# Altium schematic sheet Main.SchDoc
size 420 x 297 mm; Author: Гавриленко; Address1: Address1; Address2: Address2; Address3: Address3; Address4: Address4; SheetNumber: 1; SheetTotal: 11; DocumentType: Схема электрическая принципиальная
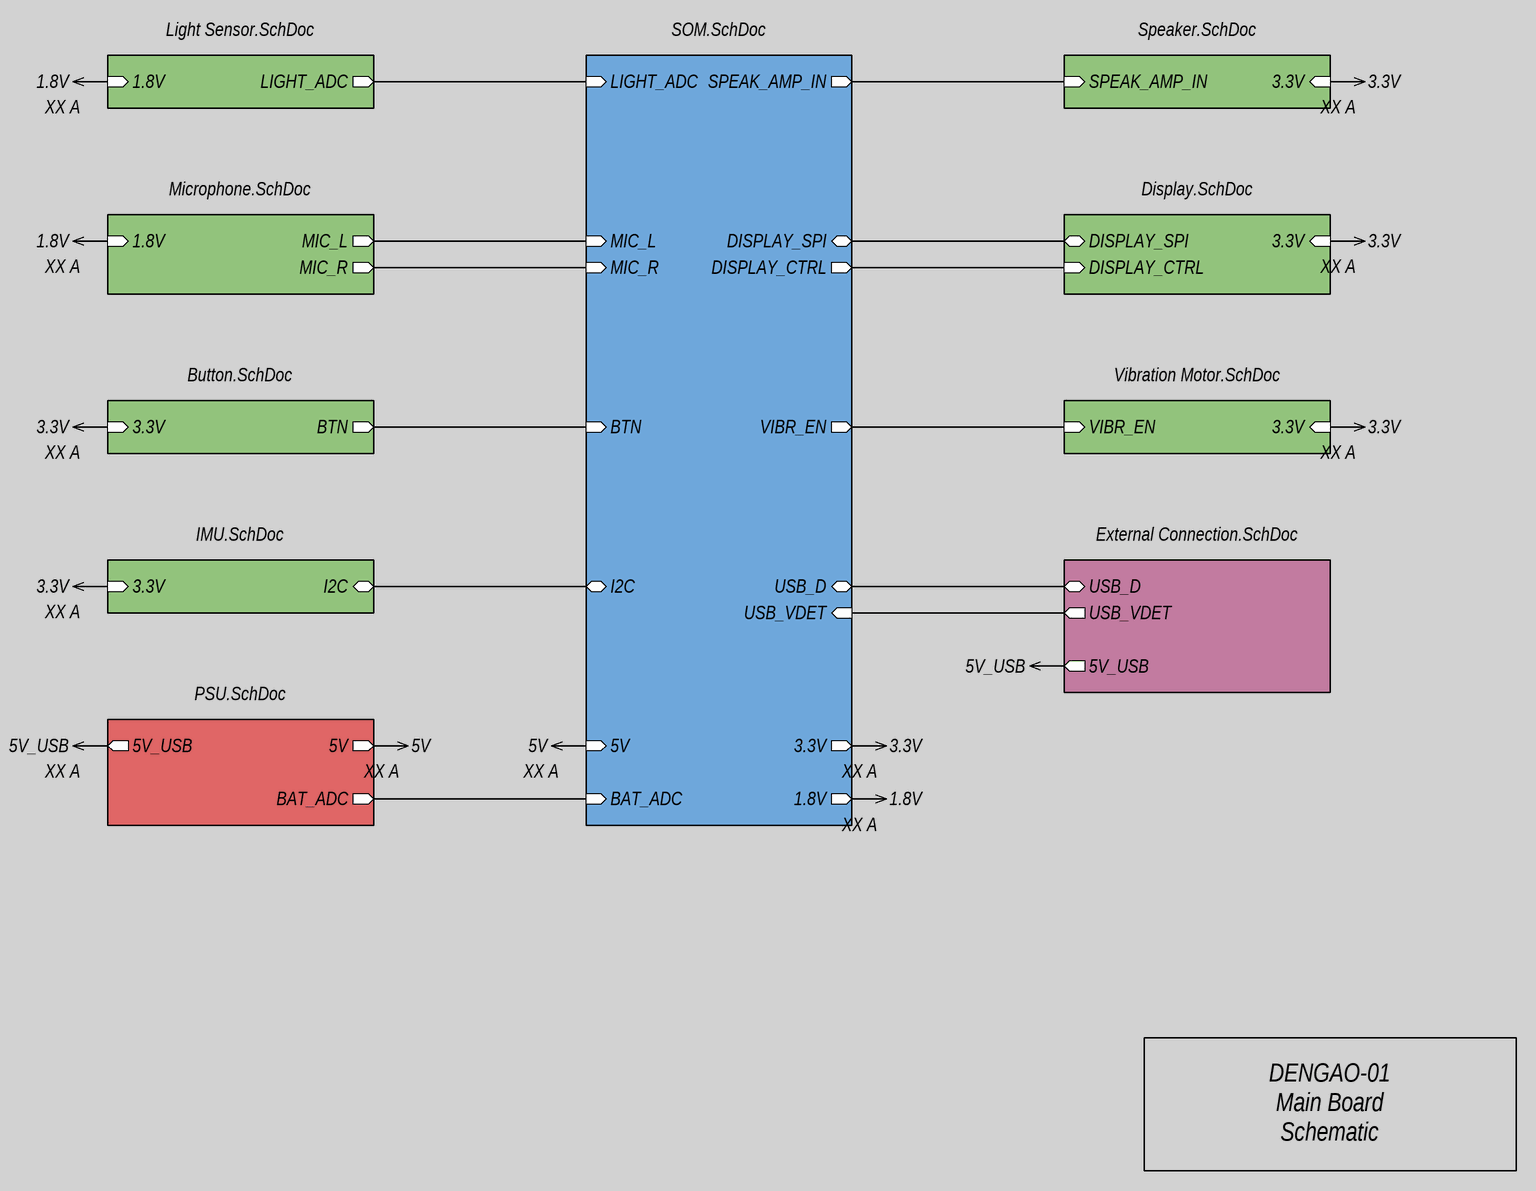
[diagram p0: Main.SchDoc]

## Sub-sheets
Designator = SOM.SchDoc: 5V (in), 3.3V (out), 1.8V (out), BAT_ADC (in), I2C (bidir), BTN (in), MIC_R (in), MIC_L (in), LIGHT_ADC (in), SPEAK_AMP_IN (out), DISPLAY_SPI (bidir), DISPLAY_CTRL (out), VIBR_EN (out), USB_D (bidir), USB_VDET (in)
Designator = IMU.SchDoc: I2C (bidir), 3.3V (in)
Designator = Microphone.SchDoc: MIC_L (out), 1.8V (in), MIC_R (out)
Designator = Speaker.SchDoc: SPEAK_AMP_IN (in), 3.3V (in)
Designator = Display.SchDoc: DISPLAY_SPI (bidir), DISPLAY_CTRL (in), 3.3V (in)
Designator = PSU.SchDoc: 5V (out), 5V_USB (out), BAT_ADC (out)
Designator = Button.SchDoc: BTN (out), 3.3V (in)
Designator = Light Sensor.SchDoc: LIGHT_ADC (out), 1.8V (in)
Designator = External Connection.SchDoc: 5V_USB (out), USB_D (bidir), USB_VDET (out)
Designator = Vibration Motor.SchDoc: VIBR_EN (in), 3.3V (in)

## Nets
1.8V: sheet Designator/1.8V, sheet Designator/1.8V, sheet Designator/1.8V
3.3V: sheet Designator/3.3V, sheet Designator/3.3V, sheet Designator/3.3V, sheet Designator/3.3V, sheet Designator/3.3V, sheet Designator/3.3V
5V: sheet Designator/5V, sheet Designator/5V
5V_USB: sheet Designator/5V_USB, sheet Designator/5V_USB
(unnamed): sheet Designator/BAT_ADC, sheet Designator/BAT_ADC
(unnamed): sheet Designator/I2C, sheet Designator/I2C
(unnamed): sheet Designator/BTN, sheet Designator/BTN
(unnamed): sheet Designator/MIC_R, sheet Designator/MIC_R
(unnamed): sheet Designator/MIC_L, sheet Designator/MIC_L
(unnamed): sheet Designator/LIGHT_ADC, sheet Designator/LIGHT_ADC
(unnamed): sheet Designator/SPEAK_AMP_IN, sheet Designator/SPEAK_AMP_IN
(unnamed): sheet Designator/DISPLAY_SPI, sheet Designator/DISPLAY_SPI
(unnamed): sheet Designator/DISPLAY_CTRL, sheet Designator/DISPLAY_CTRL
(unnamed): sheet Designator/VIBR_EN, sheet Designator/VIBR_EN
(unnamed): sheet Designator/USB_D, sheet Designator/USB_D
(unnamed): sheet Designator/USB_VDET, sheet Designator/USB_VDET

## Notes on the sheet
- XX A
- DENGAO-01
  Main Board
  Schematic
- Перв. примен.
- Справ. №
- Подп. и дата
- Инв. № дубл.
- Взам. инв. №
- Разраб.
- Изм.
- Лист
- № докум.
- Подп.
- Дата
- Лит.
- Масса
- Масштаб
- Пров.
- Т.контр.
- Листов
- Инв. № подл.
- Утв.
- Н.контр.
- Копировал
- Формат А3